# EAGLE design source_eagle (EAGLE 9.6.2)
COMPANY: ADAFRUIT INDUSTRIES; DRAWN: KTOWN; REV: A
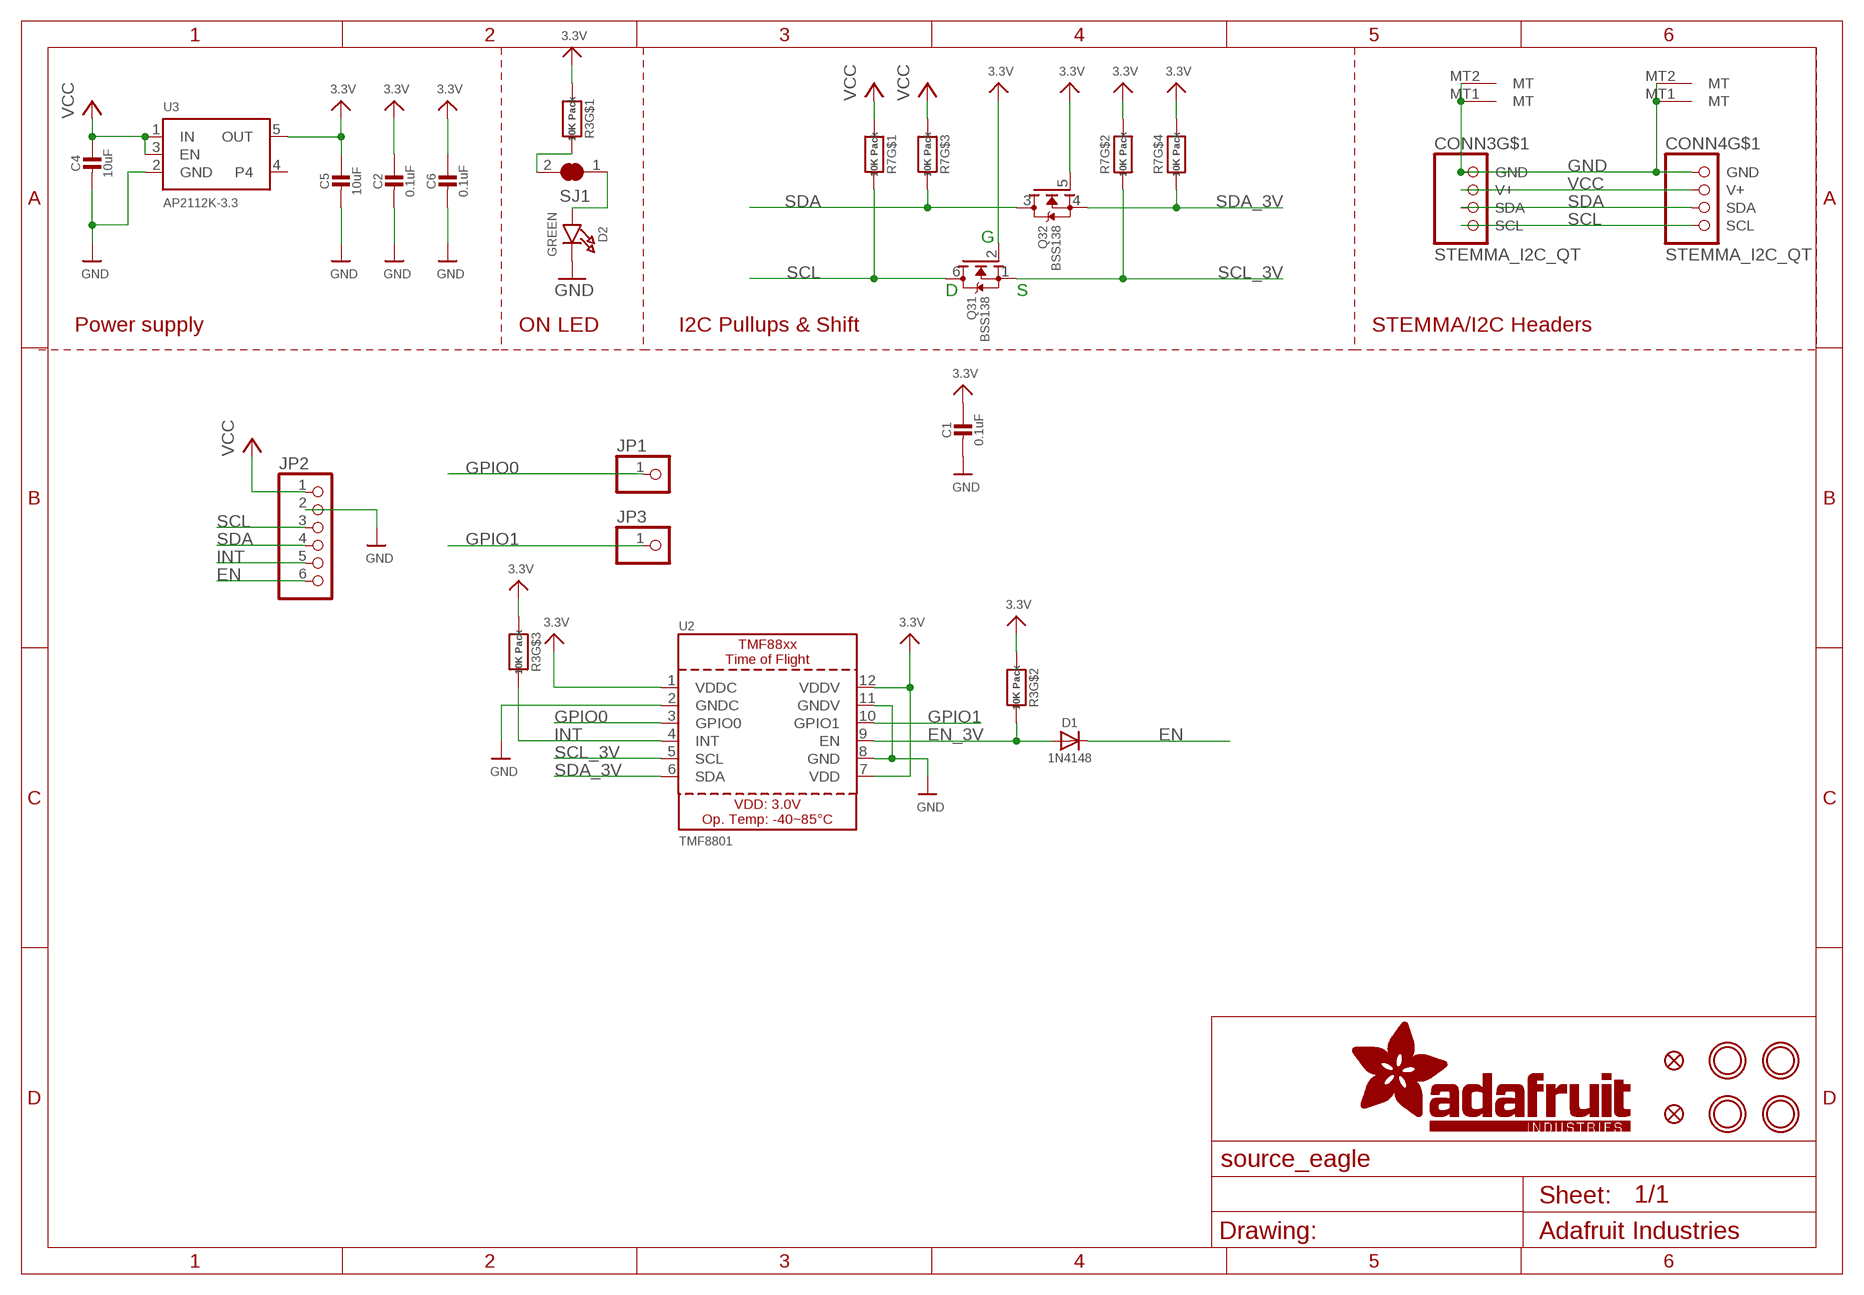
[diagram p0: schematic, sheet 1]

## Parts
C1  0.1uF  CAP_CERAMIC0603_NO  [0603-NO]
C2  0.1uF  CAP_CERAMIC0603_NO  [0603-NO]
C4  10uF  CAP_CERAMIC0805-NOOUTLINE  [0805-NO]
C5  10uF  CAP_CERAMIC0805-NOOUTLINE  [0805-NO]
C6  0.1uF  CAP_CERAMIC0603_NO  [0603-NO]
CONN3  STEMMA_I2C_QT  [JST_SH4]
CONN4  STEMMA_I2C_QT  [JST_SH4]
D1  1N4148  DIODESOD-323  [SOD-323]
D2  GREEN  LED0603_NOOUTLINE  [CHIPLED_0603_NOOUTLINE]
FID1  FIDUCIAL_0.5MM  [FIDUCIAL_0.5MM]
FID4  FIDUCIAL_0.5MM  [FIDUCIAL_0.5MM]
JP1  HEADER-1X1ROUND  [1X01_ROUND]
JP2  HEADER-1X670MIL  [1X06_ROUND_70]
JP3  HEADER-1X1ROUND  [1X01_ROUND]
Q3  BSS138  MOSFET-N_DUAL  [SOT363]
R3  10K Pack  RESISTOR_4PACK  [RESPACK_4X0603]
R7  10K Pack  RESISTOR_4PACK  [RESPACK_4X0603]
SJ1  SOLDERJUMPER_CLOSED  [SOLDERJUMPER_CLOSEDWIRE]
U2  TMF8801  TMF880X_12  [TMF880X]
U3  AP2112K-3.3  VREG_SOT23-5  [SOT23-5]
U$30  MOUNTINGHOLE2.5  [MOUNTINGHOLE_2.5_PLATED]
U$31  MOUNTINGHOLE2.5  [MOUNTINGHOLE_2.5_PLATED]
U$33  MOUNTINGHOLE2.5  [MOUNTINGHOLE_2.5_PLATED]
U$34  MOUNTINGHOLE2.5  [MOUNTINGHOLE_2.5_PLATED]

## Nets
3.3V: C1.1 C2.1 C5.1 C6.1 Q3.2(1:G) Q3.5(2:G) R3.1 R3.2 R3.3 R7.2 R7.4 U2.1(VDDC) U2.7(VDD) U2.12(VDDV) U3.5(OUT)
EN: D1.C JP2.6
EN_3V: D1.A R3.7 U2.9(EN)
GND: C1.2 C2.2 C4.2 C5.2 C6.2 CONN3.1(GND) CONN3.MT1(MT) CONN3.MT2(MT) CONN4.1(GND) CONN4.MT1(MT) CONN4.MT2(MT) D2.C JP2.2 U2.2(GNDC) U2.8(GND) U2.11(GNDV) U3.2(GND)
GPIO0: JP1.1 U2.3(GPIO0)
GPIO1: JP3.1 U2.10(GPIO1)
INT: JP2.5 R3.6 U2.4(INT)
N$1: R3.8 SJ1.2
N$2: D2.A SJ1.1
SCL: CONN3.4(SCL) CONN4.4(SCL) JP2.3 Q3.6(1:D) R7.8
SCL_3V: Q3.1(1:S) R7.7 U2.5(SCL)
SDA: CONN3.3(SDA) CONN4.3(SDA) JP2.4 Q3.3(2:D) R7.6
SDA_3V: Q3.4(2:S) R7.5 U2.6(SDA)
VCC [highpower]: C4.1 CONN3.2(V+) CONN4.2(V+) JP2.1 R7.1 R7.3 U3.1(IN) U3.3(EN)
Unconnected: R3.4 R3.5 U3.4

## Notes on the sheet
- G
- D | S
- Power supply | ON LED | I2C Pullups & Shift | STEMMA/I2C Headers

## Library data of the parts
C1 C2 C4-C6 = microbuilder:CAP_CERAMIC: Ceramic Capacitors For new designs, use the packages preceded by an '_' character since they are more reliable: The following footprints should be used on most boards: _0402 - Standard footprint for regular board layouts _0603 - Standard footprint for regular board layouts _0805 - Standard footprint for regular board layouts _1206 - Standard footprint for regular board layouts For extremely tight-pitch boards where space is at a premium, the following 'micro-pitch' footprints can be used (smaller pads, no silkscreen outline, etc.): _0402MP - Micro-pitch footprint for very dense/compact boards _0603MP - Micro-pitch footprint for very dense/compact boards _0805MP - Micro-pitch footprint for very dense/compact boards _1206MP - Micro-pitch footprint for very dense/compact boards
CONN3 CONN4 = adafruit_electromech:STEMMA_I2C; LCSC: C2845363
D1 = microbuilder:DIODE: Diode SMA Model Volts Amps Type Vf Ir Digikey # Notes SSA34-E3 40V 3A Schottky 480mV @ 3A 200uA @ 40V SSA34-E3/61TGITR-ND CDBA120-G 20V 1A Schottky 500mV @ 1A 500uA @ 20V 641-1014-6-ND REEL MBRA210 10V 2A Schottky 350mV @ 2A 700uA @ 10V MBRA210LT3 SOD-123 Model Volts Amps Type Vf Ir Order # Notes BAT54T1G 30V 200mA Schottky 800mV @ 200mA 2uA @ 25V BAT54T1GOSTR-ND B0530W 30V 500mA Schottky 430mV @ 500mA 130uA @ 30V B0530W-FDICT-ND REEL MBR120 20V 1A Schottky 340mV @ 1A MBR120VLSFT1GOSCT-ND SOD-323 Model Volts Amps Type Vf Ir Order # Notes PMEG2005EJ 20V 500mA Schottky 355mV @ 500mA 568-4110-1-ND ZLLS410 10V 570mA Schottky 380mV @ 570mA ZLLS410CT-ND 1N4148WS 75V 150mA Silicon/Simple 1V 1N4148WSFSCT-ND REEL SOD-523 Model Volts Amps Type Vf Ir Order # Notes BAT54XV2 30V 200mA Schottky 0.8V @ 100mA BAT54XV2CT-ND TB751S 30V 30mA Schottky RB751S-40TE61CT-ND SOT23-R/W (R = Solder Paste/Reflow Ovens, W = Hand-Soldering) Model Volts Amps Type Vf Ir Order # Notes BAT54FILM 40V 300mA Schottky 497-7162-1-ND POWERDI-5 Model Volts Amps Type Vf Ir Order # Notes PDS560 60V 5A Schottky 670mV @ 5A 150uA @ 60V PDS560DICT-ND
D2 = microbuilder:LED: LED 0603 - 0603 Surface Mount Package 2mA: Green LED - Low Power (3.9mcd, 2ma, 1.7Vf) - Digikey: 475-2709-2-ND Orange LED - Low Power (9.8mcd, 2ma, 1.8Vf) - Digikey: 475-1194-2-ND Red LED - Low Power (5mcd, 2ma, 1.8Vf) - Digikey: 475-1195-2-ND Yellow LED - Low Power (7mcd, 2ma, 1.8Vf) - Digikey: 475-1196-2-ND 5mA: Blue LED - Low Power (17mcd, 5ma, 2.9Vf) - Digikey: LNJ937W8CRACT-ND 0805 - 0805 Surface Mount Package 2mA: Red LED (8.8mcd, 2mA, 1.8Vf, Clear) - Low Power [Digikey: 475-2510-1-ND] Green LED (5mcd, 2mA, 1.8Vf, Clear) - Low Power [Digikey: 475-2730-1-ND] Yellow LED (11.3mcd, 2mA, 1.8Vf, Clear) - Low Power [Digikey: 475-2555-1-ND] 20mA: Red LED (104mcd, 20mA, Diffused) - LS R976 [Digikey: 475-1278-6-ND] Red LED (12mcd, 20mA, 2.0Vf, Clear) - APT2012EC [Digikey: 754-1128-1-ND] Green LED (15mcd, 20mA, 2.2Vf, Clear) - APT2012GC [Digikey: 754-1131-1-ND] Orange LED (160mcd, 20mA, 2.1Vf, Clear) - APT2012SECK [Digikey: 754-1130-1-ND] 1206 - 1206 Surface Mount Package Green LED (26mcd, 20mA, Diffused) - LG N971 [Digikey: 475-1407-6-ND] Red LED (15mcd, 20mA, Diffused) - LH N974 [Digikey: 475-1416-6-ND] Cree - Cree High-Power Surface Mount LEDs XPEBWT-L1-0000-00D50 - White 111lm 350mA 2.9Vf 6200K 110° XTEAWT-00-0000-00000LEE3 - White 114lm 350mA 2.85Vf 5000K 115° Everlight - Everlight 45-21 Series Surface Mount LEDs 45-21/QK2C-B2832AC2CB2/2T - Warm White 2000mcd 20mA 3.25Vf 3050K 120° 45-21/LK2C-B38452C4CB2/2T - Nuetral White 2000mcd 20mA 3.25Vf 4150K 120° 45-21/LK2C-B50634C6CB2/2T - Cold White 2200mcd 20mA 3.25Vf 5650K 120° PLCC2 Reverse Mount LS T77K-J1L2-1-0-2-R18-Z - Red 11.25mcd 2mA 1.8Vf 630nm 120° LO T77K-L1M2-24-Z - Orange 19.6mcd 2mA 1.8Vf 606nm 120° LY T77K-K2M1-26-Z - Yellow 15.7mcd 2mA 1.8Vf 587nm 120°; ROT: 270
FID1 FID4 = microbuilder:FIDUCIAL: Fiducial Alignment Points Various fiducial points for machine vision alignment.
JP1 JP3 = microbuilder:HEADER-1X1: PIN HEADER
JP2 = microbuilder:HEADER-1X6: PIN HEADER
Q3 = microbuilder:MOSFET-N_DUAL: Dual N-Channel MOSFET SOT363 (2.0x1.25mm) 2N7002PS - 60V, 320mA [Digikey: 568-5984-1-ND]; JLC_ROTATION: 270
R3 R7 = microbuilder:RESISTOR_4PACK: Resistor Packs (4 resistors) 4 x 0603 10K 1/16W - Digikey: YC164J-10KCT-ND
SJ1 = microbuilder:SOLDERJUMPER_CLOSED: Solder Jumper - Closed These solder jumpers are closed by default CLOSEDWIRE - 10 mil trace between pads that can be cut and resoldered later CLOSEDPERM - 63 mil trace between pads for a permanent connection (used to 'bridge' two signals, a shameless hack for Eagle). Can double as a test point as well (no cream layer)
U2 = adafruit_sensor:TMF880X
U3 = adafruit_power:VREG_SOT23-5: SOT23-5 Fixed Voltage Regulators Part Current Out V Out V In V Dropout θJA (°C/W) TJ (°C) Digikey Part No. ADP121 150mA 3.3V 3.4-5.5V 0.09V @ 150mA -- -- ADP121-AUJZ33R7CT-ND ADP121 150mA 3.0V 3.1-5.5V 0.09V @ 150mA -- -- ADP121-AUJZ30R7CT-ND ADP122 300mA 3.3V 3.4-5.5V 0.085V @ 300mA -- -- ADP122AUJZ-3.3-R7CT-ND ADP1712 300mA 3.3V 3.5-5.5V 0.17V @ 300mA -- -- ADP1712AUJZ-3.3-R7TR-ND AP7311 (Low Cost) 150mA 3.3V 3.5-6V 0.15V @ 150mA -- -- AP7311-33WG-7DICT-ND LD39015M18R 150mA 1.8V 1.9V-5.5V 0.08V @ 100mA -- -- 497-6977-1-ND LP2985A-33DBVR 150mA 3.3V 3.3-16V 0.28V @ 150mA 206 150 296-18479-1-ND MCP1824T-3302E/OT 300mA 3.3V 3.5V-6V 0.2V @ 300mA -- -- MCP1824T-3302E/OTCT-ND MIC5205-2.5YM5 TR 150mA 2.5V 2.7-16V 0.165V @ 150mA -- -- 576-1257-2-ND MIC5205-3.0YM5 TR 150mA 3.0V 3.2V-16V 0.165V @ 150mA -- -- 576-1258-2-ND MIC5205-3.3YM5 TR 150mA 3.3V 3.5V-16V 0.165V @ 150mA -- -- 576-1259-2-ND TPS780330220 150mA 3.3V+2.2V 3.6-5.5V 250mV Max -- -- 296-23332-1-ND TDA3663/N1,135 100mA 3.3V 3.5-45V 0.18V @ 50mA -- -- 568-5343-1-ND Max operating temp can be calculated using θJA, TJ (max junction temperature), and power in watts. Set the "Maximum Ambient Temperature" until it reaches TJ ("Max Junction Temperature"), which is the absolute limit for safe use of the regulator: Heat Sink Temperature Calculator <http://www.daycounter.com/Calculators/Heat-Sink-Temperature-Calculator.phtml> For example, With 12V source into a 3.3V LP2985 and a 30mA load, we are dissipating (12V-3.3V) * 0.03A = 0.261W. With a θJA of 206 °C/W, a TJ of 150°C, and 261mW we can safely use the chip without a heat sink up to 75°C (=147.1°C Junction Temperature).; JLC_ROTATION: 0
U$30 U$31 U$33 U$34 = adafruit_electromech:MOUNTINGHOLE: Mounting Hole For #2 screws (0.086"/2.18mm width, 0.094"/2.4mm hole) use 2.5mm; BOM: EXCLUDE

## Net classes
1 highpower: width 0.406 mm, drill 0.483 mm
2 lowpower: width 0.305 mm, drill 0.483 mm

## Board
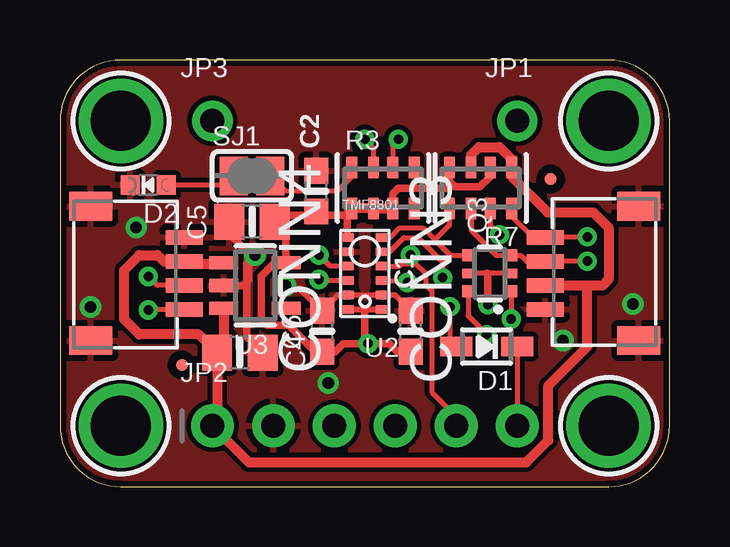
[diagram p1: board, top side]
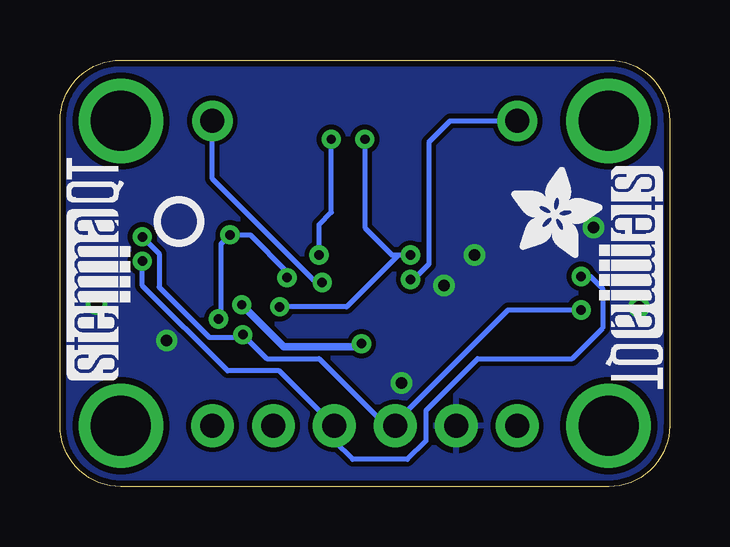
[diagram p2: board, bottom side, seen from below]

Size 25.4 x 17.78 mm. Coordinates in mm from the lower left corner, seen from the top.
Outline: 0,15.24 0,2.54 arc90 2.54,0 22.86,0 arc90 25.4,2.54 25.4,15.24 arc90 22.86,17.78 2.54,17.78 arc90 0,15.24
Copper layers (1*16): Top 0.035mm / dielectric 1.5mm / Bottom 0.035mm
Design rules "adafruit *": minimum track width 8mil, minimum drill 15.5mil, track to track 8mil, track to pad 8mil, pad to pad 8mil, via to via 8mil, smd to smd 8mil, copper to edge 10mil, drill to drill 8mil, minimum pad ring 10mil, minimum via ring 8mil, stop-mask expansion 2mil, vias tented up to drill 20mil, thermal gap 10mil

### Footprints (pad centres in the part's own frame; a part is rotated, then mirrored left to right if it is on the bottom)
0603-NO = smd 1.075 x 1: 1 -0.85,0; 2 0.85,0
0805-NO = smd 1.24 x 1.5: 1 -0.95,0; 2 0.95,0
JST_SH4 = smd 0.6 x 1.55: 1 -1.5,2.006; 2 -0.5,2.006; 3 0.5,2.006; 4 1.5,2.006 | smd 1.2 x 1.8: MT1 -2.8,-1.894; MT2 2.8,-1.894
SOD-323 = smd 1.35 x 0.8: A 1.27,0; C -1.27,0
CHIPLED_0603_NOOUTLINE = smd 0.8 x 0.8: A 0,-0.75; C 0,0.75
FIDUCIAL_0.5MM = smd 0.5 x 0.5: 1 0,0
1X01_ROUND = drill 1 pad 1.676: 1 0,0
1X06_ROUND_70 = drill 1 pad 1.778: 1 -6.35,0; 2 -3.81,0; 3 -1.27,0; 4 1.27,0; 5 3.81,0; 6 6.35,0
SOT363 = smd 0.5 x 0.5: 1 -0.75,-0.9; 3 0.75,-0.9; 4 0.75,0.9; 6 -0.75,0.9 | smd 0.4 x 0.5: 2 0,-0.9; 5 0,0.9
RESPACK_4X0603 = smd 0.45 x 0.9: 1 -1.3,-0.85; 2 -0.4,-0.85; 3 0.4,-0.85; 4 1.3,-0.85; 5 1.3,0.85; 6 0.4,0.85; 7 -0.4,0.85; 8 -1.3,0.85
SOLDERJUMPER_CLOSEDWIRE = smd 1.168 x 1.6: 1 -0.762,0; 2 0.762,0 | smd 0.635 x 0.203: WIRE 0,0
TMF880X = smd 0.575 x 0.35: 1 -0.738,1.5; 2 -0.738,0.9; 3 -0.738,0.3; 4 -0.738,-0.3; 5 -0.738,-0.9; 6 -0.738,-1.5; 7 0.738,-1.5; 8 0.738,-0.9; 9 0.738,-0.3; 10 0.738,0.3; 11 0.738,0.9; 12 0.738,1.5
SOT23-5 = smd 0.55 x 1.2: 1 -0.95,-1.3; 2 0,-1.3; 3 0.95,-1.3; 4 0.95,1.3; 5 -0.95,1.3
MOUNTINGHOLE_2.5_PLATED = drill 2.5 pad 3.2: P$1 0,0

### Placement (x,y rotation side)
C1  14.61,6.48 90 top
C2  10.67,12.32 90 top
C4  7.49,5.59 0 top
C5  8,11.05 180 top
C6  10.92,6.48 90 top
CONN3  22.23,8.89 90 top
CONN4  3.17,8.89 270 top
D1  17.78,5.84 180 top
D2  3.68,12.57 90 top
FID1  5.08,5.08 0 top
FID4  20.45,12.83 0 top
JP1  19.05,15.24 0 top
JP2  12.7,2.54 0 top
JP3  6.35,15.24 0 top
PLABEL0  [PLABEL0]  6.35,0.89 0 top
PLABEL1  [PLABEL1]  8.89,4.19 0 top
PLABEL2  [PLABEL2]  11.43,0.89 0 top
PLABEL3  [PLABEL3]  13.97,4.19 0 top
PLABEL4  [PLABEL4]  16.64,0.89 0 top
PLABEL5  [PLABEL5]  19.05,4.19 0 top
PLABEL7  [PLABEL7]  12.7,14.86 0 top
PLABEL8  [PLABEL8]  0.38,12.45 0 top
PLABEL9  [PLABEL9]  6.35,16.89 0 top
PLABEL10  [PLABEL10]  19.18,16.89 0 top
PLABEL12  [PLABEL12]  12.7,12.32 0 bottom
PLABEL14  [PLABEL14]  12.7,1.02 0 bottom
PLABEL15  [PLABEL15]  12.57,16.64 0 top
PLABEL16  [PLABEL16]  12.7,16.26 0 bottom
PLABEL17  [PLABEL17]  12.45,7.24 0 bottom
Q3  17.91,8.89 90 top
R3  13.46,12.45 0 top
R7  17.53,12.45 180 top
SJ1  8,12.95 0 top
U2  12.7,8.89 180 top
U3  8.13,8.38 270 top
U$30  2.54,15.24 0 top
U$31  22.86,15.24 0 top
U$33  2.54,2.54 0 top
U$34  22.86,2.54 0 top
U$36  [ADAFRUIT_3.5MM]  6.6,9.53 0 bottom
U$37  [PCBFEAT-REV-040]  20.45,11.05 0 bottom
U$38  [STEMMAQT]  22.48,4.45 90 bottom
U$39  [STEMMAQT]  2.92,13.34 270 bottom

### Tracks (layer width: path | path; a pad name or v marks a point on that pad's centre or on a via)
3.3V  (via drill 0.39)
  Top 0.203: Q3.2 17.78,8.89 Q3.5 | C2.1 10.67,11.32
  Top 0.254: 11.47,5.63 C6.1 | U2.12 12.7,7.39 U2.1 | 14.06,5.63 C1.1
  Top 0.305: C6.1 10.63,5.63 9.53,6.73 8.64,6.73 8.38,6.99 8.38,8.76 8.95,9.33 U3.5 9.43,9.65 9.4,9.68 9.4,10.6 C5.1 9.22,11.32 10.67,11.32 12.02,11.32 12.16,11.46 R3.1 | R7.2 17.93,12.92 17.5,12.49 16.47,12.49 16.23,12.73 | 16.23,12.73 16.23,12.45 14.1,12.45 13.86,12.21 R3.3 | 16.23,12.73 R7.4 | 17.78,8.89 17.83,8.84 v17.83,7.58 | v12.84,5.96 11.8,5.96 11.47,5.63 | R3.2 12.1,11.6 11.96,11.45 U2.7 | v12.84,5.96 12.7,6.1 12.7,7.39 | v12.84,5.96 13.73,5.96 14.06,5.63
  Top 0.406: R3.3 R3.2 R3.1
  Bottom 0.305: v17.83,7.58 16.09,5.84 12.95,5.84 v12.84,5.96
EN
  Top 0.203: D1.C JP2.6
EN_3V  (via drill 0.39)
  Top 0.203: v12.7,14.48 13.06,14.12 R3.7 | v16.25,7.49 16.25,6.1 D1.A | U2.9 11.26,9.19 v10.79,9.65
  Bottom 0.203: v12.7,14.48 12.7,10.79 11.56,9.65 v10.79,9.65 11.3,9.65 13.46,7.49 v16.25,7.49
GND  (via drill 0.48)
  Top 0.203: 11.01,7.41 11.59,7.99 U2.11 U2.2 13.94,7.99 C1.2
  Top 0.254: 11.01,7.41 C6.2 9.99,8.26 9.53,8.26 v9.4,8.38 | 7.05,10.54 C5.2
  Top 0.305: 7.05,10.54 7.88,9.71 7.88,9.24 7.87,9.23 7.87,8.64 7.62,8.38 U3.2 | C4.2 7.78,6.25 7.78,9.31 v8.13,9.65
  other vias: 11.18,4.32 20.95,6.1 23.88,7.62 3.17,10.79 1.27,7.49
  pour Top: 0,17.78 25.4,17.78 25.4,0 0,0
  pour Bottom: 0,17.78 25.4,17.78 25.4,0 0,0
GPIO0  (via drill 0.39)
  Top 0.203: v14.48,8.51 14.45,8.48 14.34,8.59 U2.3
  Bottom 0.203: JP1.1 19.05,12.83 14.73,8.51 v14.48,8.51
GPIO1  (via drill 0.39)
  Top 0.203: U2.10 10.84,8.59 v10.79,8.64
  Bottom 0.203: v10.79,8.64 10.67,8.64 10.03,9.27 10.03,14.35 9.14,15.24 JP3.1
INT  (via drill 0.39)
  Top 0.203: v14.61,9.65 14.25,9.3 | v14.1,14.48 13.86,14.24 R3.6 | 14.25,9.3 14.83,9.3 15.24,8.89 15.24,8.42 15.49,8.17 15.49,3.94 16.51,2.92 JP2.5 | U2.4 14.14,9.19 14.25,9.3
  Bottom 0.203: v14.61,9.65 14.61,10.92 14.1,11.43 v14.1,14.48
N$1
  Top 0.203: SJ1.2 9.4,12.32 11.56,12.32 12.16,12.92 R3.8
N$2
  Top 0.203: D2.A 6.86,12.57 SJ1.1
SCL  (via drill 0.39)
  Top 0.203: R7.8 18.83,11.27 19.71,10.39 CONN3.4 20.24,10.41 v21.97,10.41 | Q3.6 17.01,7.12 v17.78,6.35 v17.78,6.34 | v3.68,7.37 3.71,7.39 CONN4.4
  Bottom 0.203: v21.97,10.41 21.27,9.71 21.27,8.31 19.18,6.22 17.89,6.22 v17.78,6.34 16.78,5.33 14.61,5.33 11.81,2.54 JP2.3 11.43,2.67 6.73,7.37 v3.68,7.37
SCL_3V  (via drill 0.39)
  Top 0.203: R7.7 17.93,10.88 v18.32,10.49 | Q3.1 18.8,8.13 v18.8,6.99 | v15.95,8.71 15.95,9.35 14.92,10.37 14.33,10.37 13.75,9.79 U2.5
  Bottom 0.203: v18.8,6.99 18.7,7.08 18.7,10.11 v18.32,10.49 17.47,10.49 15.95,8.97 v15.95,8.71
SDA  (via drill 0.39)
  Top 0.203: R7.6 17.13,10.69 18.17,9.64 Q3.3 19.19,9.64 19.44,9.39 CONN3.3 v21.96,9.39 v21.97,9.4 | CONN4.3 4.06,8.39 v3.68,8.76
  Bottom 0.203: v21.97,9.4 21.97,8.38 18.41,4.83 16.26,4.83 JP2.4 13.97,1.91 13.21,1.14 10.92,1.14 10.16,1.91 10.16,3.17 8,5.33 4.06,5.33 2.79,6.6 2.79,8.26 3.3,8.76 v3.68,8.76
SDA_3V
  Top 0.203: Q3.4 16.27,9.64 15.62,10.29 | R7.5 16.23,10.89 15.62,10.29 | U2.6 13.77,10.39 14.16,10.78 15.13,10.78 15.62,10.29
VCC
  Top 0.406: U3.1 6.77,9.27 5.3,9.27 CONN4.2 4.33,9.39 4.06,9.65 3.3,9.65 2.67,9.02 2.67,6.99 3.3,6.35 5.78,6.35 C4.1 | U3.3 6.83,5.87 C4.1 | C4.1 6.54,2.73 JP2.1 7.87,1.02 19.43,1.02 20.34,1.93 20.34,4.22 21.97,5.84 21.97,8.38 | 21.97,8.38 22.61,8.38 22.86,8.64 22.86,10.79 22.23,11.43 20.32,11.43 18.83,12.92 R7.1 18.83,13.65 18.32,14.15 17.45,14.15 17.13,13.82 R7.3 | 21.97,8.38 CONN3.2

### Text on the board
Pinguin_tBackup: TMF8801
Pinguin_bBackup: TMF8801 | 2.5 Meter Range / I2C addr: 0x29 / GPIO0/1 are 3V only!